# Altium schematic sheet OBC_My_FPGA.SchDoc
size A2
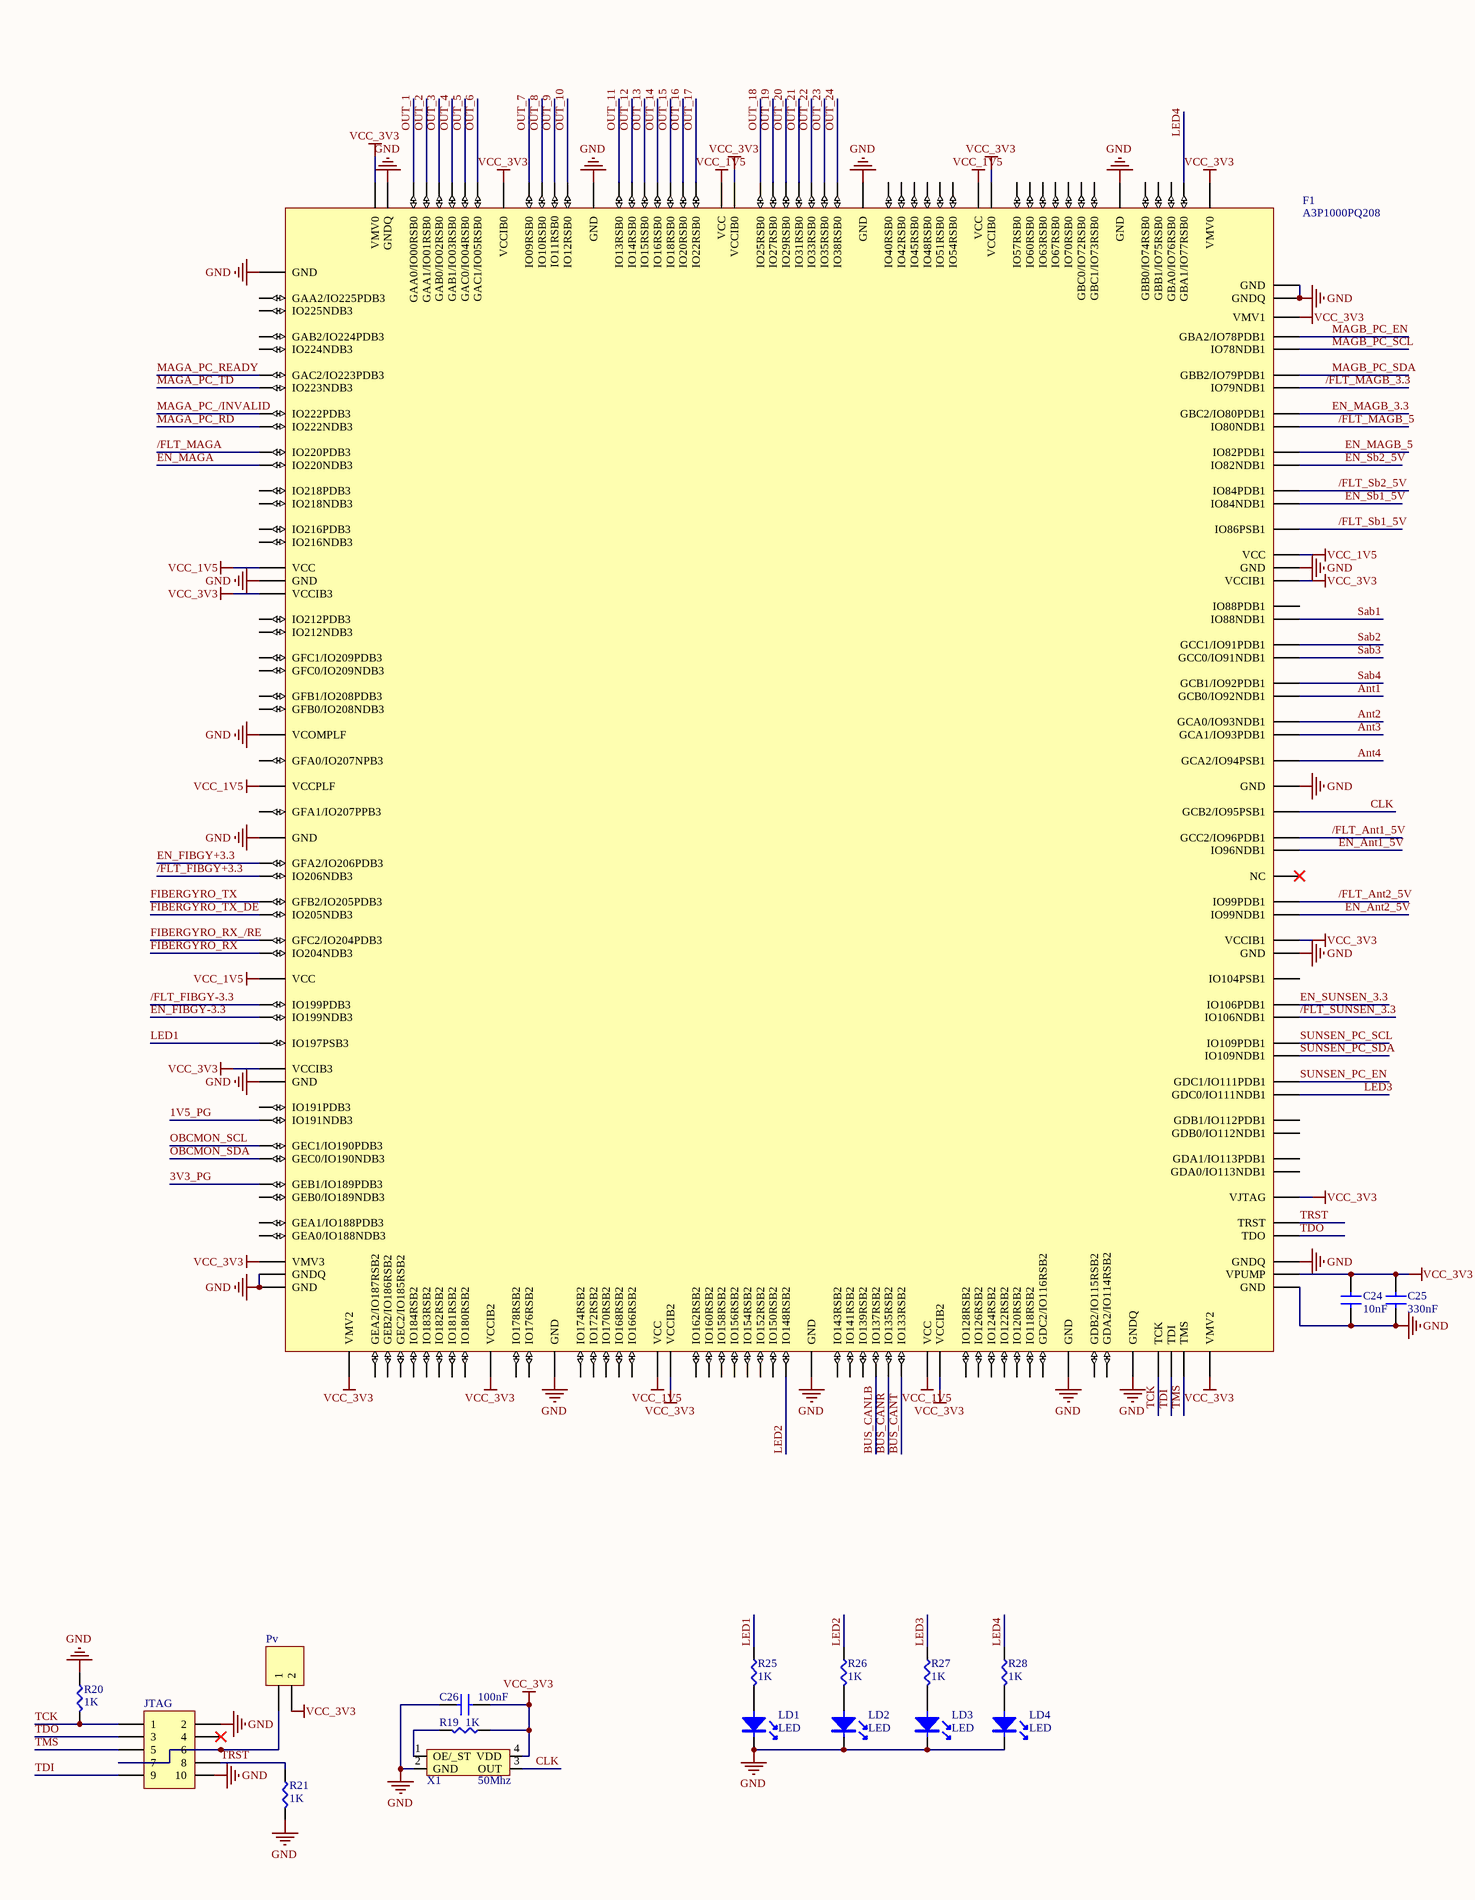
[diagram p0: OBC_My_FPGA.SchDoc, left]
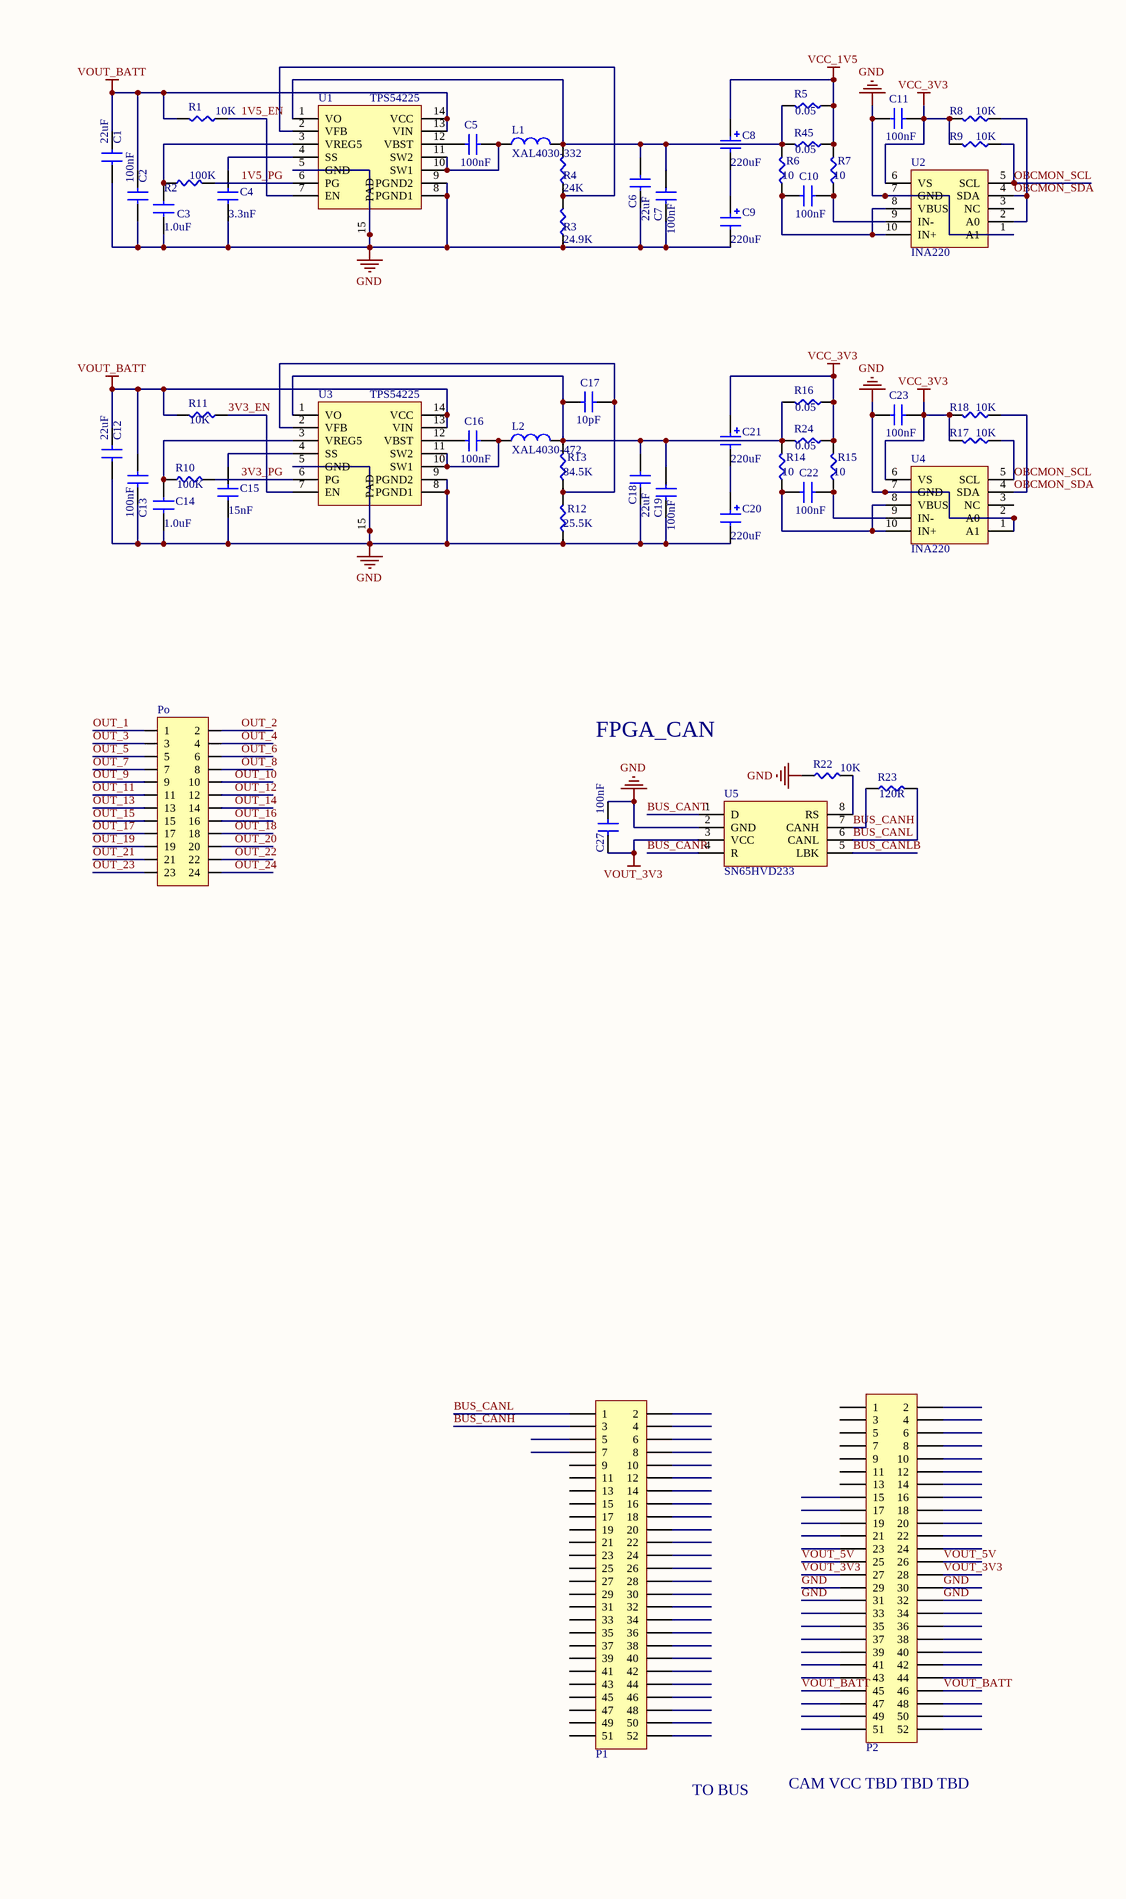
[diagram p1: OBC_My_FPGA.SchDoc, right]

## Parts
C1  22uF  [1210(3225)-C-IPC]
C2  100nF  [0805(2012)-C-IPC]
C3  1.0uF  [0603(1608)-C-IPC]
C4  3.3nF  [0603(1608)-C-IPC]
C5  100nF  [0603(1608)-C-IPC]
C6  22uF  [1210(3225)-C-IPC]
C7  100nF  [0805(2012)-C-IPC]
C8  220uF  [TanCap-D(7343)-C-IPC]
C9  220uF  [TanCap-D(7343)-C-IPC]
C10  100nF  [0603(1608)-C-IPC]
C11  100nF  [0603(1608)-C-IPC]
C12  22uF  [1210(3225)-C-IPC]
C13  100nF  [0805(2012)-C-IPC]
C14  1.0uF  [0603(1608)-C-IPC]
C15  15nF  [0603(1608)-C-IPC]
C16  100nF  [0603(1608)-C-IPC]
C17  10pF  [0603(1608)-C-IPC]
C18  22uF  [1210(3225)-C-IPC]
C19  100nF  [0805(2012)-C-IPC]
C20  220uF  [TanCap-D(7343)-C-IPC]
C21  220uF  [TanCap-D(7343)-C-IPC]
C22  100nF  [0603(1608)-C-IPC]
C23  100nF  [0603(1608)-C-IPC]
C24  10nF  [0603(1608)-C-IPC]
C25  330nF  [0603(1608)-C-IPC]
C26  100nF  [0603(1608)-C-IPC]
C27  100nF  [0603(1608)-C-IPC]
F1  A3P1000PQ208  [SQFP50P3060X3060X410-208N]
JTAG  Header 5X2  [HDR2X5]  (value not drawn)
L1  XAL4030-332  [Inductor-CoilCraft-XAL40xx]
L2  XAL4030-472  [Inductor-CoilCraft-XAL40xx]
LD1  LED  [0603(1608)-C-IPC]
LD2  LED  [0603(1608)-C-IPC]
LD3  LED  [0603(1608)-C-IPC]
LD4  LED  [0603(1608)-C-IPC]
P1  Header 26X2H  [DIP 26x2-2.54mm]  (value not drawn)
P2  Header 26X2H  [DIP 26x2-2.54mm]  (value not drawn)
Po  Header 12x2  [DIP 12x2-2.54mm]  (value not drawn)
Pv  Header 2  [HDR1X2]  (value not drawn)
R1  10K  [0603(1608)-R-IPC]
R2  100K  [0603(1608)-R-IPC]
R3  24.9K  [0603(1608)-R-IPC]
R4  24K  [0603(1608)-R-IPC]
R5  0.05  [1206(3216)-R-IPC]
R6  10  [0603(1608)-R-IPC]
R7  10  [0603(1608)-R-IPC]
R8  10K  [0603(1608)-R-IPC]
R9  10K  [0603(1608)-R-IPC]
R10  100K  [0603(1608)-R-IPC]
R11  10K  [0603(1608)-R-IPC]
R12  25.5K  [0603(1608)-R-IPC]
R13  84.5K  [0603(1608)-R-IPC]
R14  10  [0603(1608)-R-IPC]
R15  10  [0603(1608)-R-IPC]
R16  0.05  [1206(3216)-R-IPC]
R17  10K  [0603(1608)-R-IPC]
R18  10K  [0603(1608)-R-IPC]
R19  1K  [0603(1608)-R-IPC]
R20  1K  [0603(1608)-R-IPC]
R21  1K  [0603(1608)-R-IPC]
R22  10K  [0603(1608)-R-IPC]
R23  value 120R  [0603(1608)-R-IPC]  (hidden comment: 120)
R24  0.05  [1206(3216)-R-IPC]
R25  1K  [0603(1608)-R-IPC]
R26  1K  [0603(1608)-R-IPC]
R27  1K  [0603(1608)-R-IPC]
R28  1K  [0603(1608)-R-IPC]
R45  0.05  [1206(3216)-R-IPC]
U1  TPS54225  [TSSOP-14-4.4x5-0.65-w.TP-IPC]
U2  INA220  [TSSOP-10-3x3-IPC]
U3  TPS54225  [TSSOP-14-4.4x5-0.65-w.TP-IPC]
U4  INA220  [TSSOP-10-3x3-IPC]
U5  SN65HVD233  [SOP-8-3.9x4.9-IPC]
X1  50Mhz  [LC-SMD-3225_4P]

## Nets
GND: C1.2 C2.2 C3.1 C4.1 C6.2 C7.2 C9.2 C11.2 C12.2 C13.2 C14.1 C15.1 C18.2 C19.2 C20.2 C23.2 C24.2 C25.2 C26.2 C27.2 F1.1(GND) F1.17(GND) F1.25(VCOMPLF) F1.29(GND) F1.41(GND) F1.51(GNDQ) F1.52(GND) F1.65(GND) F1.81(GND) F1.97(GND) F1.100(GNDQ) F1.105(GND) F1.107(GNDQ) F1.122(GND) F1.130(GND) F1.141(GND) F1.155(GNDQ) F1.156(GND) F1.162(GND) F1.178(GND) F1.195(GND) F1.207(GNDQ) JTAG.2 LD1.2(K) LD2.2(K) LD3.2(K) LD4.2(K) P2.29 P2.30 P2.31 P2.32 R3.1 R12.1 R20.1 R21.2 R22.1 U1.5(GND) U1.8(PGND1) U1.9(PGND2) U1.15(PAD) U2.1(A1) U2.7(GND) U3.5(GND) U3.8(PGND1) U3.9(PGND2) U3.15(PAD) U4.1(A1) U4.2(A0) U4.7(GND) U5.2(GND) X1.2(GND)
VCC_1V5: C8.1 F1.16(VCC) F1.27(VCCPLF) F1.36(VCC) F1.71(VCC) F1.88(VCC) F1.142(VCC) F1.171(VCC) F1.187(VCC) R5.1 R7.2 R45.1
VCC_3V3: C11.1 C21.1 C23.1 C24.1 C25.1 C26.1 F1.18(VCCIB3) F1.40(VCCIB3) F1.50(VMV3) F1.53(VMV2) F1.62(VCCIB2) F1.72(VCCIB2) F1.89(VCCIB2) F1.104(VMV2) F1.106(VPUMP) F1.110(VJTAG) F1.123(VCCIB1) F1.140(VCCIB1) F1.154(VMV1) F1.157(VMV0) F1.170(VCCIB0) F1.186(VCCIB0) F1.200(VCCIB0) F1.208(VMV0) Pv.2 R8.2 R9.2 R15.2 R16.1 R17.2 R18.2 R19.1 R24.1 U2.6(VS) U4.6(VS) X1.4(VDD)
VOUT_3V3: C27.1 P2.27 P2.28 U5.3(VCC)
VOUT_BATT: C1.1 C2.1 C12.1 C13.1 P2.45 P2.46 R1.2 R11.2 U1.13(VIN) U1.14(VCC) U3.13(VIN) U3.14(VCC)
1V5_EN: R1.1 U1.7(EN)
1V5_PG: F1.43(IO191NDB3) R2.2 U1.6(PG)
3V3_EN: R11.1 U3.7(EN)
3V3_PG: F1.46(GEB1/IO189PDB3) R10.2 U3.6(PG)
/FLT_Ant1_5V: F1.128(GCC2/IO96PDB1)
/FLT_Ant2_5V: F1.125(IO99PDB1)
/FLT_FIBGY+3.3: F1.31(IO206NDB3)
/FLT_FIBGY-3.3: F1.37(IO199PDB3)
/FLT_MAGA: F1.10(IO220PDB3)
/FLT_MAGB_3.3: F1.150(IO79NDB1)
/FLT_MAGB_5: F1.148(IO80NDB1)
/FLT_Sb1_5V: F1.143(IO86PSB1)
/FLT_Sb2_5V: F1.145(IO84PDB1)
/FLT_SUNSEN_3.3: F1.119(IO106NDB1)
Ant1: F1.134(GCB0/IO92NDB1)
Ant2: F1.133(GCA0/IO93NDB1)
Ant3: F1.132(GCA1/IO93PDB1)
Ant4: F1.131(GCA2/IO94PSB1)
BUS_CANH: P1.3 R23.1 U5.7(CANH)
BUS_CANL: P1.1 R23.2 U5.6(CANL)
BUS_CANLB: F1.85(IO137RSB2) U5.5(LBK)
BUS_CANR: F1.86(IO135RSB2) U5.4(R)
BUS_CANT: F1.87(IO133RSB2) U5.1(D)
CLK: F1.129(GCB2/IO95PSB1) X1.3(OUT)
EN_Ant1_5V: F1.127(IO96NDB1)
EN_Ant2_5V: F1.124(IO99NDB1)
EN_FIBGY+3.3: F1.30(GFA2/IO206PDB3)
EN_FIBGY-3.3: F1.38(IO199NDB3)
EN_MAGA: F1.11(IO220NDB3)
EN_MAGB_3.3: F1.149(GBC2/IO80PDB1)
EN_MAGB_5: F1.147(IO82PDB1)
EN_Sb1_5V: F1.144(IO84NDB1)
EN_Sb2_5V: F1.146(IO82NDB1)
EN_SUNSEN_3.3: F1.120(IO106PDB1)
FIBERGYRO_RX: F1.35(IO204NDB3)
FIBERGYRO_RX_/RE: F1.34(GFC2/IO204PDB3)
FIBERGYRO_TX: F1.32(GFB2/IO205PDB3)
FIBERGYRO_TX_DE: F1.33(IO205NDB3)
LED1: F1.39(IO197PSB3) R25.1
LED2: F1.80(IO148RSB2) R26.1
LED3: F1.115(GDC0/IO111NDB1) R27.1
LED4: F1.158(GBA1/IO77RSB0) R28.1
MAGA_PC_/INVALID: F1.8(IO222PDB3)
MAGA_PC_RD: F1.9(IO222NDB3)
MAGA_PC_READY: F1.6(GAC2/IO223PDB3)
MAGA_PC_TD: F1.7(IO223NDB3)
MAGB_PC_EN: F1.153(GBA2/IO78PDB1)
MAGB_PC_SCL: F1.152(IO78NDB1)
MAGB_PC_SDA: F1.151(GBB2/IO79PDB1)
OBCMON_SCL: F1.44(GEC1/IO190PDB3) R9.1 R17.1 U2.5(SCL) U4.5(SCL)
OBCMON_SDA: F1.45(GEC0/IO190NDB3) R8.1 R18.1 U2.2(A0) U2.4(SDA) U4.4(SDA)
OUT_1: F1.206(GAA0/IO00RSB0) Po.1
OUT_2: F1.205(GAA1/IO01RSB0) Po.2
OUT_3: F1.204(GAB0/IO02RSB0) Po.3
OUT_4: F1.203(GAB1/IO03RSB0) Po.4
OUT_5: F1.202(GAC0/IO04RSB0) Po.5
OUT_6: F1.201(GAC1/IO05RSB0) Po.6
OUT_7: F1.199(IO09RSB0) Po.7
OUT_8: F1.198(IO10RSB0) Po.8
OUT_9: F1.197(IO11RSB0) Po.9
OUT_10: F1.196(IO12RSB0) Po.10
OUT_11: F1.194(IO13RSB0) Po.11
OUT_12: F1.193(IO14RSB0) Po.12
OUT_13: F1.192(IO15RSB0) Po.13
OUT_14: F1.191(IO16RSB0) Po.14
OUT_15: F1.190(IO18RSB0) Po.15
OUT_16: F1.189(IO20RSB0) Po.16
OUT_17: F1.188(IO22RSB0) Po.17
OUT_18: F1.185(IO25RSB0) Po.18
OUT_19: F1.184(IO27RSB0) Po.19
OUT_20: F1.183(IO29RSB0) Po.20
OUT_21: F1.182(IO31RSB0) Po.21
OUT_22: F1.181(IO33RSB0) Po.22
OUT_23: F1.180(IO35RSB0) Po.23
OUT_24: F1.179(IO38RSB0) Po.24
Sab1: F1.138(IO88NDB1)
Sab2: F1.137(GCC1/IO91PDB1)
Sab3: F1.136(GCC0/IO91NDB1)
Sab4: F1.135(GCB1/IO92PDB1)
SUNSEN_PC_EN: F1.116(GDC1/IO111PDB1)
SUNSEN_PC_SCL: F1.118(IO109PDB1)
SUNSEN_PC_SDA: F1.117(IO109NDB1)
TCK: F1.101(TCK) JTAG.1 R20.2
TDI: F1.102(TDI) JTAG.9
TDO: F1.108(TDO) JTAG.3
TMS: F1.103(TMS) JTAG.5
TRST: F1.109(TRST) JTAG.8 R21.1
VOUT_5V: P2.25 P2.26
NetC3_2: C3.2 R2.1 U1.3(VREG5)
NetC4_2: C4.2 U1.4(SS)
NetC5_1: C5.1 L1.1 U1.10(SW1) U1.11(SW2)
NetC5_2: C5.2 U1.12(VBST)
NetC6_1: C6.1 C7.1 L1.2 R4.2 R5.2 R6.2 R45.2 U1.1(VO)
NetC8_2: C8.2 C9.1
NetC10_1: C10.1 R7.1 U2.9(IN-)
NetC10_2: C10.2 R6.1 U2.8(VBUS) U2.10(IN+)
NetC14_2: C14.2 R10.1 U3.3(VREG5)
NetC15_2: C15.2 U3.4(SS)
NetC16_1: C16.1 L2.1 U3.10(SW1) U3.11(SW2)
NetC16_2: C16.2 U3.12(VBST)
NetC17_1: C17.1 R12.2 R13.1 U3.2(VFB)
NetC17_2: C17.2 C18.1 C19.1 L2.2 R13.2 R14.2 R16.2 R24.2 U3.1(VO)
NetC20_1: C20.1 C21.2
NetC22_1: C22.1 R15.1 U4.9(IN-)
NetC22_2: C22.2 R14.1 U4.8(VBUS) U4.10(IN+)
NetJTAG_6: JTAG.6 JTAG.7 Pv.1
NetLD1_1: LD1.1(A) R25.2
NetLD2_1: LD2.1(A) R26.2
NetLD3_1: LD3.1(A) R27.2
NetLD4_1: LD4.1(A) R28.2
NetR3_2: R3.2 R4.1 U1.2(VFB)
NetR19_2: R19.2 X1.1(OE/_ST)
NetR22_2: R22.2 U5.8(RS)

Not connected (* = marked no-connect by the designer): F1 2(GAA2/IO225PDB3) 3(IO225NDB3) 4(GAB2/IO224PDB3) 5(IO224NDB3) 12(IO218PDB3) 13(IO218NDB3) 14(IO216PDB3) 15(IO216NDB3) 19(IO212PDB3) 20(IO212NDB3) 21(GFC1/IO209PDB3) 22(GFC0/IO209NDB3) 23(GFB1/IO208PDB3) 24(GFB0/IO208NDB3) 26(GFA0/IO207NPB3) 28(GFA1/IO207PPB3) 42(IO191PDB3) 47(GEB0/IO189NDB3) 48(GEA1/IO188PDB3) 49(GEA0/IO188NDB3) 54(GEA2/IO187RSB2) 55(GEB2/IO186RSB2) 56(GEC2/IO185RSB2) 57(IO184RSB2) 58(IO183RSB2) 59(IO182RSB2) 60(IO181RSB2) 61(IO180RSB2) 63(IO178RSB2) 64(IO176RSB2) 66(IO174RSB2) 67(IO172RSB2) 68(IO170RSB2) 69(IO168RSB2) 70(IO166RSB2) 73(IO162RSB2) 74(IO160RSB2) 75(IO158RSB2) 76(IO156RSB2) 77(IO154RSB2) 78(IO152RSB2) 79(IO150RSB2) 82(IO143RSB2) 83(IO141RSB2) 84(IO139RSB2) 90(IO128RSB2) 91(IO126RSB2) 92(IO124RSB2) 93(IO122RSB2) 94(IO120RSB2) 95(IO118RSB2) 96(GDC2/IO116RSB2) 98(GDB2/IO115RSB2) 99(GDA2/IO114RSB2) 111(GDA0/IO113NDB1) 112(GDA1/IO113PDB1) 113(GDB0/IO112NDB1) 114(GDB1/IO112PDB1) 121(IO104PSB1) 126(NC)* 139(IO88PDB1) 159(GBA0/IO76RSB0) 160(GBB1/IO75RSB0) 161(GBB0/IO74RSB0) 163(GBC1/IO73RSB0) 164(GBC0/IO72RSB0) 165(IO70RSB0) 166(IO67RSB0) 167(IO63RSB0) 168(IO60RSB0) 169(IO57RSB0) 172(IO54RSB0) 173(IO51RSB0) 174(IO48RSB0) 175(IO45RSB0) 176(IO42RSB0) 177(IO40RSB0); JTAG 4* 10; P1 2 4 5 6 7 8 9 10 11 12 13 14 15 16 17 18 19 20 21 22 23 24 25 26 27 28 29 30 31 32 33 34 35 36 37 38 39 40 41 42 43 44 45 46 47 48 49 50 51 52; P2 1 2 3 4 5 6 7 8 9 10 11 12 13 14 15 16 17 18 19 20 21 22 23 24 33 34 35 36 37 38 39 40 41 42 43 44 47 48 49 50 51 52; U2 3(NC); U4 3(NC)

## Notes on the sheet
- FPGA_CAN
- TO BUS
- (near P2) CAM VCC TBD TBD TBD
- Labels drawn without touching a wire or pin: GND

## Library data of the parts
C1-C7 C10-C19 C22-C27 = Cap_1: Nonpolarized Capacitor (Surface Mount)
  C1 C6 C12 C18: Value: 22uF
  C2 C5 C7 C10 C11 C13 C16 C19 C22 C23 C26 C27: Value: 100nF
  C3 C14: Value: 1.0uF
  C4: Value: 3.3nF
  C15: Value: 15nF
  C17: Value: 10pF
  C24: Value: 10nF
  C25: Value: 330nF
C8 C9 C20 C21 = Cap Pol_1: Polarized Capacitor (Surface Mount); Value: 220uF
F1 = A3P100PQ208: ProASIC3 Flash Family FPGAs
JTAG = Header 5X2: Header, 5-Pin, Dual row; LatestRevisionDate: 17-Jul-2002; LatestRevisionNote: Re-released for DXP Platform.; Publisher: Altium Limited
L1 L2 = Inductor_1: Inductor
P1 P2 = Header 26X2H: Header, 26-Pin, Dual row, Right Angle
Pv = Header 2: Header, 2-Pin; LatestRevisionDate: 17-Jul-2002; LatestRevisionNote: Re-released for DXP Platform.; Publisher: Altium Limited
R1-R28 R45 = Res_1: Resistor
  R1 R8 R9 R11 R17 R18 R22: Value: 10K
  R2 R10: Value: 100K
  R3: Value: 24.9K
  R4: Value: 24K
  R5 R16 R24 R45: Value: 0.05
  R6 R7 R14 R15: Value: 10
  R12: Value: 25.5K
  R13: Value: 84.5K
  R19-R21 R25-R28: Value: 1K
U1 U3 = TPS54225: 4.5V to 18V Input, 2-A Synchronous Step-Down SWIFT Converter
U2 U4 = INA220: High- or Low-Side, Bidirectional Current and Power Monitor With Two-Wire Interface
U5 = SN65HVD233: 3.3-V CAN Bus Transceivers
X1 = SiT1602: Standard Frequency Oscillator SiT1602